# Altium schematic sheet TOF.SchDoc
size A
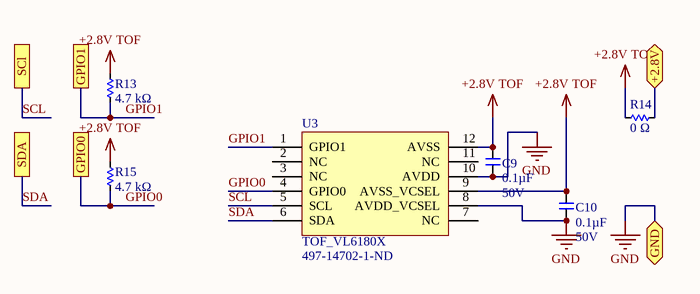
[diagram p0: TOF.SchDoc]

## Parts
C9  Capacitance (shorthand): 0.1µF  Rated Voltage: 50V  [C0603]  (hidden comment: __template_cap)
C10  Capacitance (shorthand): 0.1µF  Rated Voltage: 50V  [C0603]  (hidden comment: __template_cap)
R13  Resistance: 4.7 kΩ  [R0805]  (hidden comment: __template_resistor)
R14  Resistance: 0 Ω  [R0805]  (hidden comment: __template_resistor)
R15  Resistance: 4.7 kΩ  [R0805]  (hidden comment: __template_resistor)
U3  TOF_VL6180X  Supplier Part Number 1: 497-14702-1-ND  [TOF_VL6180X]

## Ports
+2.8V (bidir), GND (bidir), GPIO0, GPIO1, SCl, SDA

## Nets
+2.8V TOF: C9.1 C10.1 R13.2 R14.1 R15.2 U3.9(AVSS_VCSEL) U3.12(AVSS)
GND: C9.2 C10.2 U3.8(AVDD_VCSEL) U3.10(AVDD) ; port GND
+2.8V: R14.2 ; port +2.8V
GPIO0: R15.1 U3.4(GPIO0) ; port GPIO0
GPIO1: R13.1 U3.1(GPIO1) ; port GPIO1
SCL: U3.5(SCL) ; port SCl
SDA: U3.6(SDA) ; port SDA

Not connected (* = marked no-connect by the designer): U3 2(NC) 3(NC) 7(NC) 11(NC)

## Library data of the parts
C9 C10 = CAP CER 0603 0.1µF X7R 50V 10%: Manufacturer: Murata Electronics North America; Capacitance - pF (Machine readable): 100000; type: capacitor; Dielectric: X7R; Supplier 1: Digikey; Supplier Part Number 1: 490-1519-1-ND
R13 R15 = RES SMD 4.7K OHM 1% 1/8W 0805: Manufacturer Part Number: RC0805FR-074K7L; Manufacturer: Yageo; Resistance (Sortable): 4700; Tolerance: ±1%; Power (Watts): 0.125W, 1/8W; Temperature Coefficient: ±100ppm/°C; Supplier 1: Digikey; Datasheets: http://www.yageo.com/documents/recent/PYu-RC_Group_51_RoHS_L_9.pdf; Image: //media.digikey.com/Renders/Yageo%20Renders/0805-(2012-Metric).jpg; Supplier Part Number 1: 311-4.70KCRCT-ND; Operating Temperature: -55°C ~ 155°C
R14 = RES SMD 0 OHM JUMPER 1/8W 0805: Manufacturer Part Number: RC0805FR-070RL; Manufacturer: Yageo; Resistance (Sortable): 0; Tolerance: Jumper; Power (Watts): 0.125W, 1/8W; Supplier 1: Digikey; Datasheets: http://www.yageo.com/documents/recent/PYu-RC_Group_51_RoHS_L_9.pdf; Image: //media.digikey.com/Renders/Yageo%20Renders/0805-(2012-Metric).jpg; Supplier Part Number 1: 311-0.0CRCT-ND; Temperature Coefficient: -; Operating Temperature: -55°C ~ 155°C
U3 = TOF_VL6180X: Proximity and ambient light sensing (ALS) module; Manufacturer: STMicroelectronics; Manufacturer Part Number: VL6180XV0NR/1; Proximity Detection: Yes; Output Type: I²C; Voltage - Supply: 2.6 V ~ 3 V; Supplier 1: Digi-Key; RoHS: RoHS Compliant; Category: Sensors, Transducers; Stock 1: 2774; Pricing 1: 1=4.91, 10=4.413, 100=3.6153 (USD); Packaging: Cut Tape (CT); Part Status: Active; Type: Ambient; Wavelength: -; Operating Temperature: -10°C ~ 60°C; Mounting Type: Surface Mount; Package / Case: 12-SMD Module; Supplier Device Package: 12-SMD; ComponentLink1URL: http://www.st.com/content/ccc/resource/technical/document/datasheet/c4/11/28/86/e6/26/44/b3/DM00112632.pdf/files/DM00112632.pdf/jcr:content/translations/en.DM00112632.pdf; ComponentLink1Description: http://www.st.com/content/ccc/resource/technical/document/datasheet/c4/11/28/86/e6/26/44/b3/DM00112632.pdf/files/DM00112632.pdf/jcr:content/translations/en.DM00112632.pdf